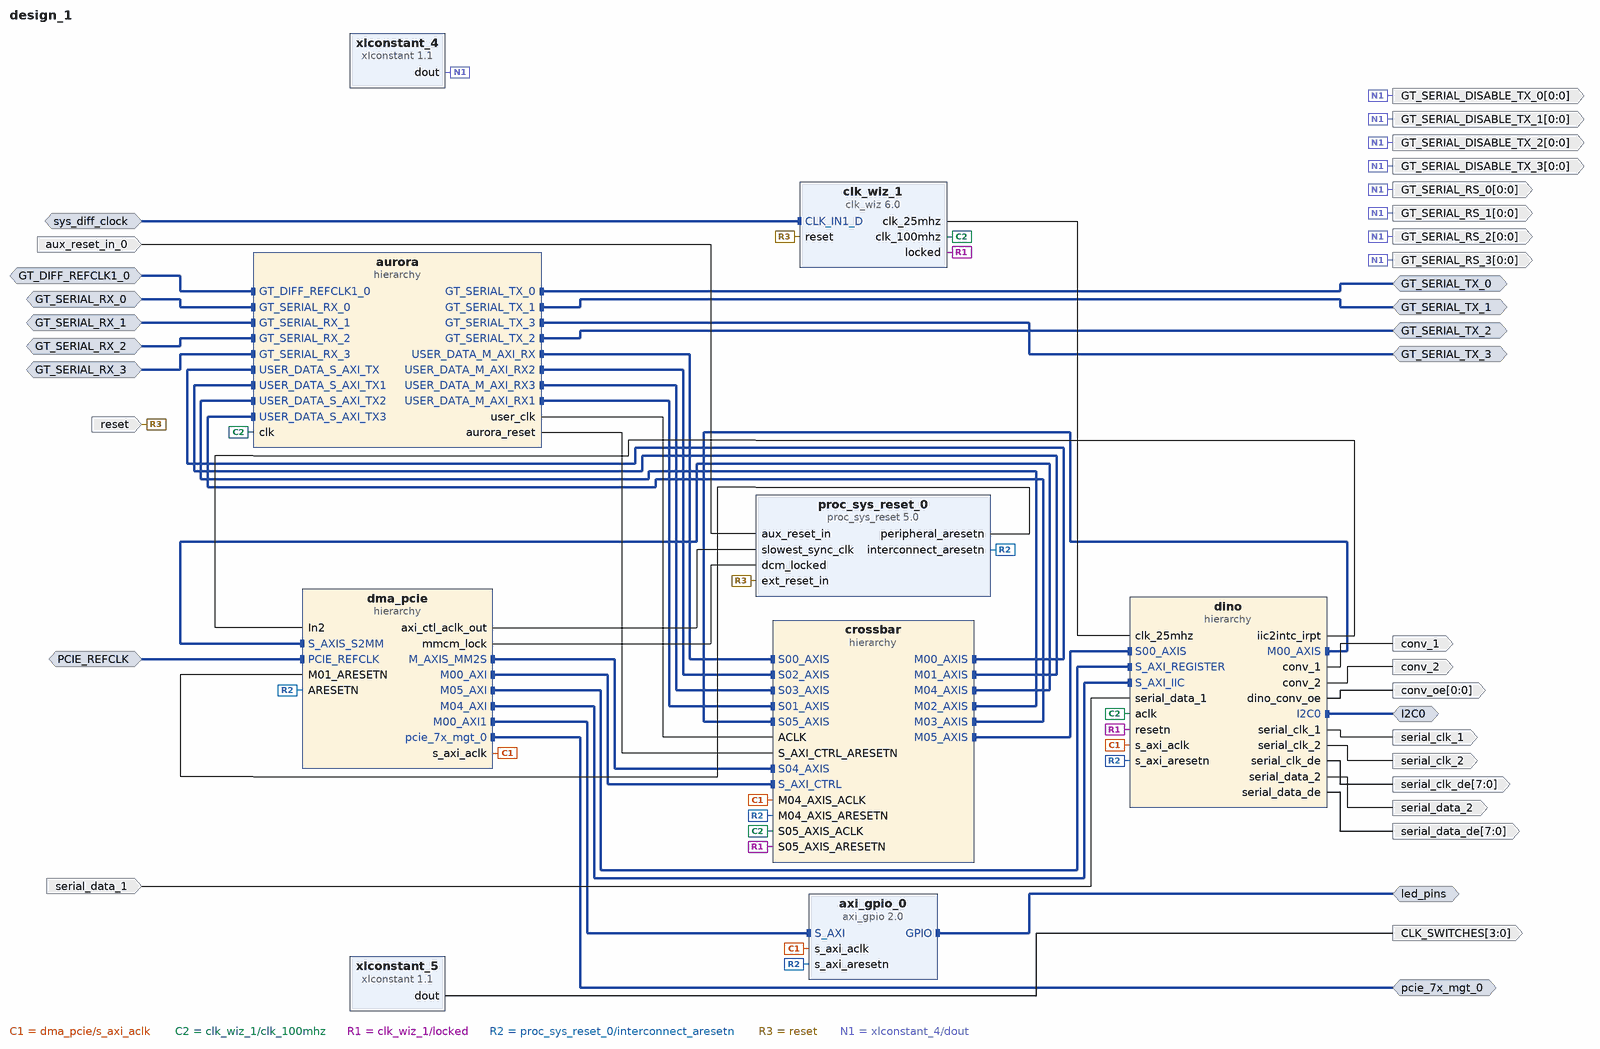
[diagram p0: block diagram of the top level]
# Vivado block design design_1, xc7vx485tffg1761-2, Vivado 2021.1
create_bd_design design_1

create_bd_intf_port -mode Slave -vlnv xilinx.com:display_aurora:GT_Serial_Transceiver_Pins_RX_rtl:1.0 GT_SERIAL_RX_0
create_bd_intf_port -mode Master -vlnv xilinx.com:display_aurora:GT_Serial_Transceiver_Pins_TX_rtl:1.0 GT_SERIAL_TX_0
create_bd_intf_port -mode Slave -vlnv xilinx.com:interface:diff_clock_rtl:1.0 GT_DIFF_REFCLK1_0
set_property -dict {CONFIG.FREQ_HZ 250000000} [get_bd_intf_ports GT_DIFF_REFCLK1_0]
create_bd_intf_port -mode Slave -vlnv xilinx.com:display_aurora:GT_Serial_Transceiver_Pins_RX_rtl:1.0 GT_SERIAL_RX_1
create_bd_intf_port -mode Master -vlnv xilinx.com:display_aurora:GT_Serial_Transceiver_Pins_TX_rtl:1.0 GT_SERIAL_TX_1
create_bd_intf_port -mode Slave -vlnv xilinx.com:interface:diff_clock_rtl:1.0 sys_diff_clock
set_property -dict {CONFIG.FREQ_HZ 200000000} [get_bd_intf_ports sys_diff_clock]
create_bd_intf_port -mode Slave -vlnv xilinx.com:display_aurora:GT_Serial_Transceiver_Pins_RX_rtl:1.0 GT_SERIAL_RX_2
create_bd_intf_port -mode Slave -vlnv xilinx.com:display_aurora:GT_Serial_Transceiver_Pins_RX_rtl:1.0 GT_SERIAL_RX_3
create_bd_intf_port -mode Master -vlnv xilinx.com:display_aurora:GT_Serial_Transceiver_Pins_TX_rtl:1.0 GT_SERIAL_TX_2
create_bd_intf_port -mode Master -vlnv xilinx.com:display_aurora:GT_Serial_Transceiver_Pins_TX_rtl:1.0 GT_SERIAL_TX_3
create_bd_intf_port -mode Slave -vlnv xilinx.com:interface:diff_clock_rtl:1.0 PCIE_REFCLK
create_bd_intf_port -mode Master -vlnv xilinx.com:interface:gpio_rtl:1.0 led_pins
create_bd_intf_port -mode Master -vlnv xilinx.com:interface:pcie_7x_mgt_rtl:1.0 pcie_7x_mgt_0
create_bd_intf_port -mode Master -vlnv xilinx.com:interface:iic_rtl:1.0 I2C0
create_bd_port -dir I -type rst reset
set_property -dict {CONFIG.POLARITY ACTIVE_HIGH} [get_bd_ports reset]
create_bd_port -dir O -from 0 -to 0 GT_SERIAL_DISABLE_TX_1
create_bd_port -dir O -from 0 -to 0 GT_SERIAL_DISABLE_TX_0
create_bd_port -dir O -from 3 -to 0 CLK_SWITCHES
create_bd_port -dir O -from 0 -to 0 GT_SERIAL_DISABLE_TX_2
create_bd_port -dir O -from 0 -to 0 GT_SERIAL_DISABLE_TX_3
create_bd_port -dir O -from 0 -to 0 GT_SERIAL_RS_0
create_bd_port -dir O -from 0 -to 0 GT_SERIAL_RS_1
create_bd_port -dir O -from 0 -to 0 GT_SERIAL_RS_2
create_bd_port -dir O -from 0 -to 0 GT_SERIAL_RS_3
create_bd_port -dir I -type rst aux_reset_in_0
create_bd_port -dir I serial_data_1
create_bd_port -dir O conv_1
create_bd_port -dir O -type clk serial_clk_1
set_property -dict {CONFIG.FREQ_HZ 25000000} [get_bd_ports serial_clk_1]
create_bd_port -dir O serial_data_2
create_bd_port -dir O -type clk serial_clk_2
set_property -dict {CONFIG.FREQ_HZ 25000000} [get_bd_ports serial_clk_2]
create_bd_port -dir O conv_2
create_bd_port -dir O -from 0 -to 0 conv_oe
create_bd_port -dir O -from 7 -to 0 serial_data_de
create_bd_port -dir O -from 7 -to 0 serial_clk_de

create_bd_cell -type ip -vlnv xilinx.com:ip:xlconstant:1.1 xlconstant_4
set_property -dict {CONFIG.CONST_VAL 0} [get_bd_cells xlconstant_4]
create_bd_cell -type ip -vlnv xilinx.com:ip:xlconstant:1.1 xlconstant_5
set_property -dict {CONFIG.CONST_VAL 0b0101 CONFIG.CONST_WIDTH 4} [get_bd_cells xlconstant_5]
create_bd_cell -type ip -vlnv xilinx.com:ip:proc_sys_reset:5.0 proc_sys_reset_0
set_property -dict {CONFIG.RESET_BOARD_INTERFACE reset} [get_bd_cells proc_sys_reset_0]
create_bd_cell -type ip -vlnv xilinx.com:ip:axi_gpio:2.0 axi_gpio_0
set_property -dict {CONFIG.GPIO_BOARD_INTERFACE led_8bits} [get_bd_cells axi_gpio_0]
create_bd_cell -type hier dma_pcie
create_bd_cell -type hier aurora
create_bd_cell -type hier crossbar
create_bd_cell -type ip -vlnv xilinx.com:ip:clk_wiz:6.0 clk_wiz_1
set_property -dict [list \
  CONFIG.CLKIN1_JITTER_PS 50.0 \
  CONFIG.CLKOUT1_DRIVES BUFG \
  CONFIG.CLKOUT1_JITTER 136.686 \
  CONFIG.CLKOUT1_PHASE_ERROR 105.461 \
  CONFIG.CLKOUT2_DRIVES BUFG \
  CONFIG.CLKOUT2_JITTER 180.172 \
  CONFIG.CLKOUT2_PHASE_ERROR 105.461 \
  CONFIG.CLKOUT2_REQUESTED_OUT_FREQ 25.000 \
  CONFIG.CLKOUT2_USED true \
  CONFIG.CLKOUT3_DRIVES BUFG \
  CONFIG.CLKOUT4_DRIVES BUFG \
  CONFIG.CLKOUT5_DRIVES BUFG \
  CONFIG.CLKOUT6_DRIVES BUFG \
  CONFIG.CLKOUT7_DRIVES BUFG \
  CONFIG.CLK_IN1_BOARD_INTERFACE sys_diff_clock \
  CONFIG.CLK_OUT1_PORT clk_100mhz \
  CONFIG.CLK_OUT2_PORT clk_25mhz \
  CONFIG.FEEDBACK_SOURCE FDBK_AUTO \
  CONFIG.MMCM_BANDWIDTH OPTIMIZED \
  CONFIG.MMCM_CLKFBOUT_MULT_F 9 \
  CONFIG.MMCM_CLKIN1_PERIOD 5.000 \
  CONFIG.MMCM_CLKIN2_PERIOD 10.0 \
  CONFIG.MMCM_CLKOUT0_DIVIDE_F 9 \
  CONFIG.MMCM_CLKOUT1_DIVIDE 36 \
  CONFIG.MMCM_COMPENSATION ZHOLD \
  CONFIG.MMCM_DIVCLK_DIVIDE 2 \
  CONFIG.NUM_OUT_CLKS 2 \
  CONFIG.PRIMITIVE PLL \
  CONFIG.PRIM_IN_FREQ 200.000 \
  CONFIG.PRIM_SOURCE Differential_clock_capable_pin \
  CONFIG.RESET_BOARD_INTERFACE reset \
  CONFIG.USE_BOARD_FLOW true \
] [get_bd_cells clk_wiz_1]
create_bd_cell -type hier dino

# ---- hierarchy /dma_pcie ----
current_bd_instance /dma_pcie
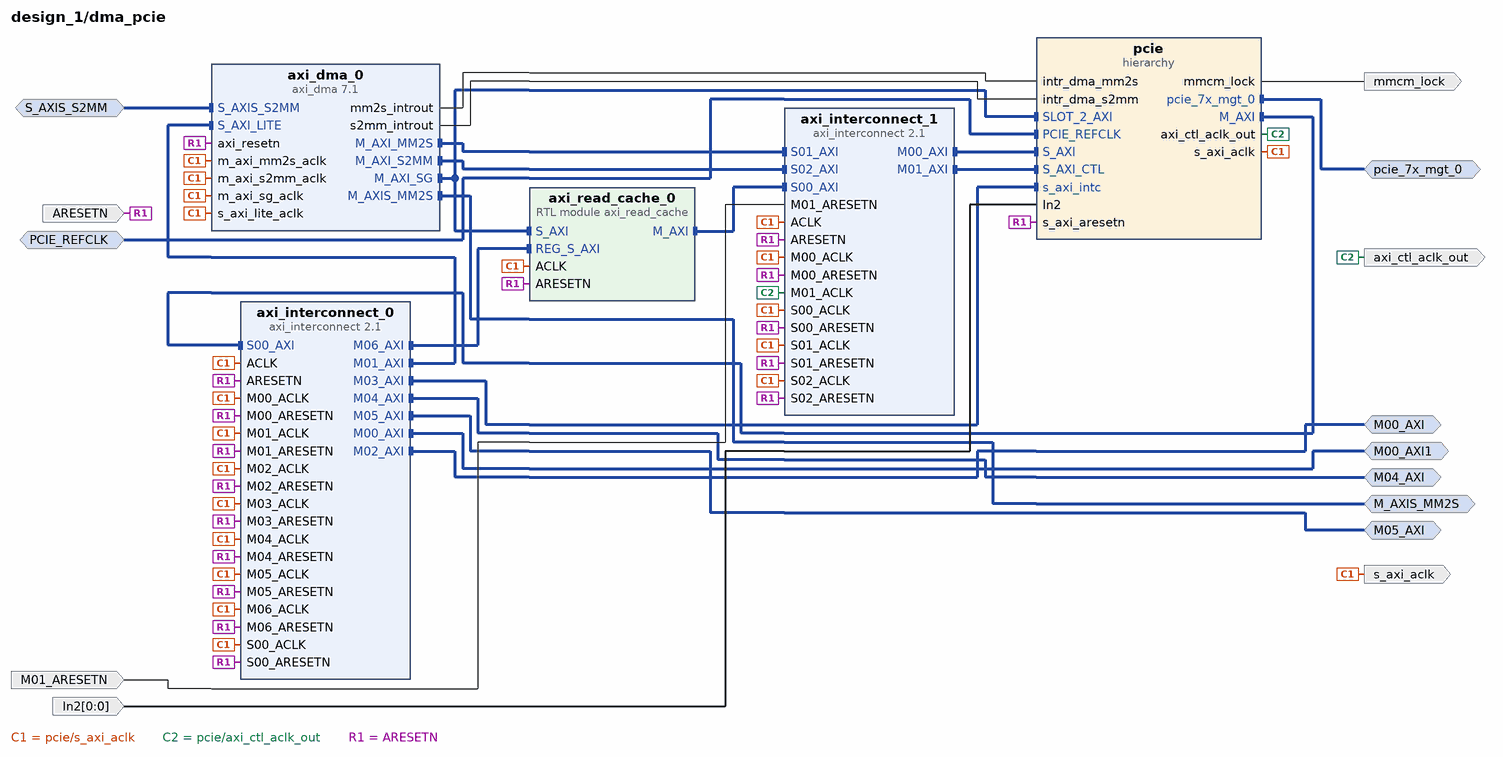
[diagram p1: block diagram inside /dma_pcie]
create_bd_intf_pin -mode Master -vlnv xilinx.com:interface:aximm_rtl:1.0 M00_AXI
create_bd_intf_pin -mode Master -vlnv xilinx.com:interface:axis_rtl:1.0 M_AXIS_MM2S
create_bd_intf_pin -mode Slave -vlnv xilinx.com:interface:axis_rtl:1.0 S_AXIS_S2MM
create_bd_intf_pin -mode Master -vlnv xilinx.com:interface:aximm_rtl:1.0 M00_AXI1
create_bd_intf_pin -mode Slave -vlnv xilinx.com:interface:diff_clock_rtl:1.0 PCIE_REFCLK
create_bd_intf_pin -mode Master -vlnv xilinx.com:interface:pcie_7x_mgt_rtl:1.0 pcie_7x_mgt_0
create_bd_intf_pin -mode Master -vlnv xilinx.com:interface:aximm_rtl:1.0 M04_AXI
create_bd_intf_pin -mode Master -vlnv xilinx.com:interface:aximm_rtl:1.0 M05_AXI
create_bd_pin -dir O -type clk s_axi_aclk
create_bd_pin -dir I -type rst ARESETN
create_bd_pin -dir O -type clk axi_ctl_aclk_out
create_bd_pin -dir I -type rst M01_ARESETN
create_bd_pin -dir O mmcm_lock
create_bd_pin -dir I -from 0 -to 0 In2

create_bd_cell -type ip -vlnv xilinx.com:ip:axi_dma:7.1 axi_dma_0
set_property -dict {CONFIG.c_include_sg 1 CONFIG.c_micro_dma 0 CONFIG.c_sg_include_stscntrl_strm 0} [get_bd_cells axi_dma_0]
create_bd_cell -type ip -vlnv xilinx.com:ip:axi_interconnect:2.1 axi_interconnect_0
set_property -dict {CONFIG.NUM_MI 7} [get_bd_cells axi_interconnect_0]
create_bd_cell -type ip -vlnv xilinx.com:ip:axi_interconnect:2.1 axi_interconnect_1
set_property -dict {CONFIG.NUM_MI 2 CONFIG.NUM_SI 3} [get_bd_cells axi_interconnect_1]
create_bd_cell -type hier pcie
create_bd_cell -type module -reference axi_read_cache axi_read_cache_0

# ---- hierarchy /dma_pcie/pcie ----
current_bd_instance /dma_pcie/pcie
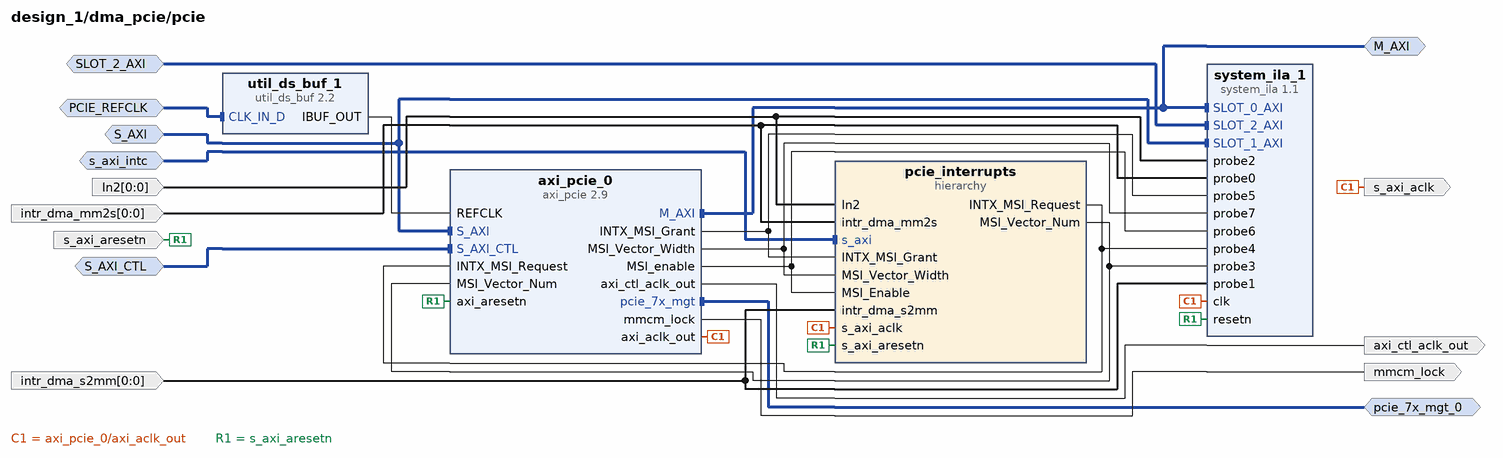
[diagram p2: block diagram inside /dma_pcie/pcie]
create_bd_intf_pin -mode Slave -vlnv xilinx.com:interface:diff_clock_rtl:1.0 PCIE_REFCLK
create_bd_intf_pin -mode Master -vlnv xilinx.com:interface:aximm_rtl:1.0 M_AXI
create_bd_intf_pin -mode Slave -vlnv xilinx.com:interface:aximm_rtl:1.0 S_AXI
create_bd_intf_pin -mode Slave -vlnv xilinx.com:interface:aximm_rtl:1.0 S_AXI_CTL
create_bd_intf_pin -mode Master -vlnv xilinx.com:interface:pcie_7x_mgt_rtl:1.0 pcie_7x_mgt_0
create_bd_intf_pin -mode Slave -vlnv xilinx.com:interface:aximm_rtl:1.0 s_axi_intc
create_bd_intf_pin -mode Monitor -vlnv xilinx.com:interface:aximm_rtl:1.0 SLOT_2_AXI
create_bd_pin -dir I -type rst s_axi_aresetn
create_bd_pin -dir O -type clk s_axi_aclk
create_bd_pin -dir O -type clk axi_ctl_aclk_out
create_bd_pin -dir O mmcm_lock
create_bd_pin -dir I -from 0 -to 0 intr_dma_mm2s
create_bd_pin -dir I -from 0 -to 0 intr_dma_s2mm
create_bd_pin -dir I -from 0 -to 0 In2

create_bd_cell -type ip -vlnv xilinx.com:ip:util_ds_buf:2.2 util_ds_buf_1
set_property -dict {CONFIG.C_BUF_TYPE IBUFDSGTE} [get_bd_cells util_ds_buf_1]
create_bd_cell -type ip -vlnv xilinx.com:ip:axi_pcie:2.9 axi_pcie_0
set_property -dict [list \
  CONFIG.AXIBAR2PCIEBAR_0 0x00000000 \
  CONFIG.BAR0_SCALE Megabytes \
  CONFIG.BAR0_SIZE 1 \
  CONFIG.DEVICE_ID 0x7021 \
  CONFIG.MAX_LINK_SPEED 5.0_GT/s \
  CONFIG.M_AXI_DATA_WIDTH 64 \
  CONFIG.NUM_MSI_REQ 4 \
  CONFIG.S_AXI_DATA_WIDTH 64 \
  CONFIG.XLNX_REF_BOARD VC707 \
] [get_bd_cells axi_pcie_0]
create_bd_cell -type hier pcie_interrupts
create_bd_cell -type ip -vlnv xilinx.com:ip:system_ila:1.1 system_ila_1
set_property -dict [list \
  CONFIG.C_DATA_DEPTH 16384 \
  CONFIG.C_MON_TYPE MIX \
  CONFIG.C_NUM_MONITOR_SLOTS 3 \
  CONFIG.C_NUM_OF_PROBES 8 \
  CONFIG.C_SLOT 2 \
  CONFIG.C_SLOT_2_INTF_TYPE xilinx.com:interface:aximm_rtl:1.0 \
  CONFIG.C_SLOT_3_INTF_TYPE xilinx.com:interface:axis_rtl:1.0 \
] [get_bd_cells system_ila_1]

# ---- hierarchy /dma_pcie/pcie/pcie_interrupts ----
current_bd_instance /dma_pcie/pcie/pcie_interrupts
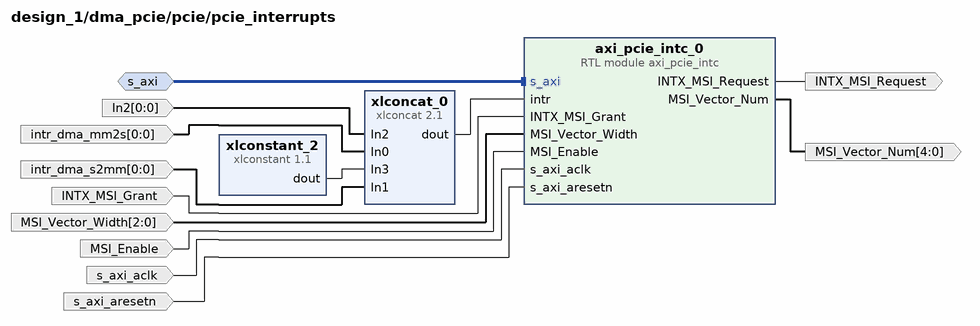
[diagram p3: block diagram inside /dma_pcie/pcie/pcie_interrupts]
create_bd_intf_pin -mode Slave -vlnv xilinx.com:interface:aximm_rtl:1.0 s_axi
create_bd_pin -dir I -from 0 -to 0 intr_dma_mm2s
create_bd_pin -dir I -from 0 -to 0 intr_dma_s2mm
create_bd_pin -dir I -type clk s_axi_aclk
create_bd_pin -dir I -type rst s_axi_aresetn
create_bd_pin -dir O INTX_MSI_Request
create_bd_pin -dir I INTX_MSI_Grant
create_bd_pin -dir O -from 4 -to 0 MSI_Vector_Num
create_bd_pin -dir I MSI_Enable
create_bd_pin -dir I -from 2 -to 0 MSI_Vector_Width
create_bd_pin -dir I -from 0 -to 0 In2

create_bd_cell -type ip -vlnv xilinx.com:ip:xlconcat:2.1 xlconcat_0
set_property -dict {CONFIG.NUM_PORTS 4} [get_bd_cells xlconcat_0]
create_bd_cell -type ip -vlnv xilinx.com:ip:xlconstant:1.1 xlconstant_2
set_property -dict {CONFIG.CONST_VAL 0 CONFIG.CONST_WIDTH 1} [get_bd_cells xlconstant_2]
create_bd_cell -type module -reference axi_pcie_intc axi_pcie_intc_0

# ---- hierarchy /aurora ----
current_bd_instance /aurora
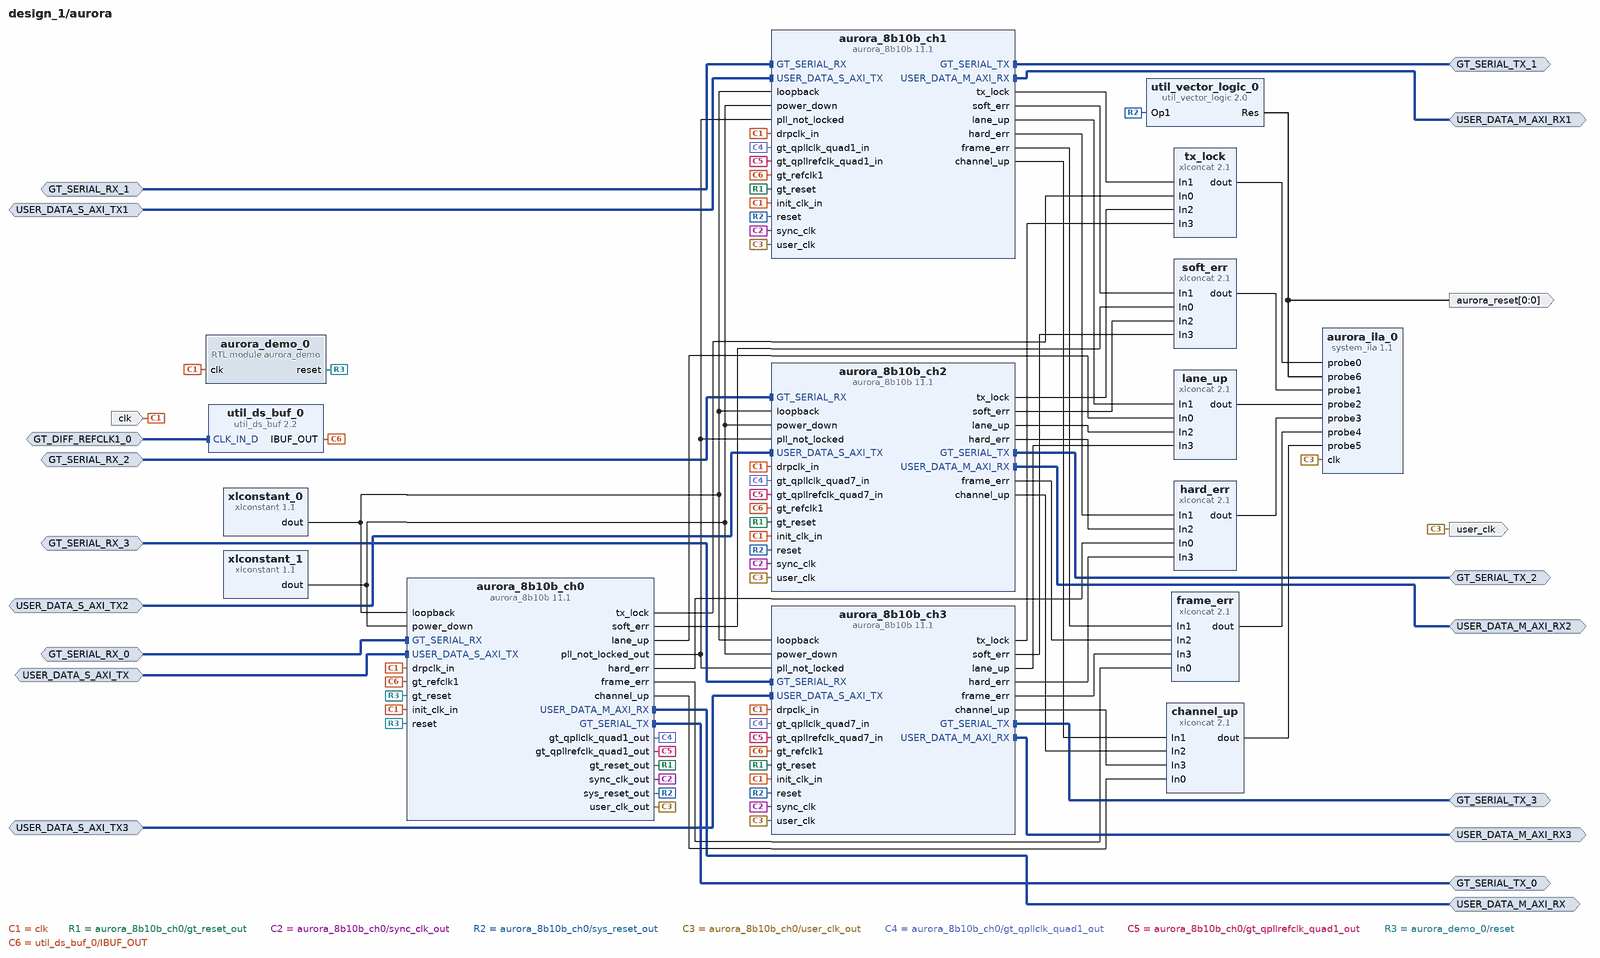
[diagram p4: block diagram inside /aurora]
create_bd_intf_pin -mode Slave -vlnv xilinx.com:interface:diff_clock_rtl:1.0 GT_DIFF_REFCLK1_0
create_bd_intf_pin -mode Slave -vlnv xilinx.com:interface:axis_rtl:1.0 USER_DATA_S_AXI_TX
create_bd_intf_pin -mode Master -vlnv xilinx.com:interface:axis_rtl:1.0 USER_DATA_M_AXI_RX
create_bd_intf_pin -mode Master -vlnv xilinx.com:display_aurora:GT_Serial_Transceiver_Pins_TX_rtl:1.0 GT_SERIAL_TX_0
create_bd_intf_pin -mode Slave -vlnv xilinx.com:display_aurora:GT_Serial_Transceiver_Pins_RX_rtl:1.0 GT_SERIAL_RX_0
create_bd_intf_pin -mode Slave -vlnv xilinx.com:interface:axis_rtl:1.0 USER_DATA_S_AXI_TX1
create_bd_intf_pin -mode Master -vlnv xilinx.com:interface:axis_rtl:1.0 USER_DATA_M_AXI_RX1
create_bd_intf_pin -mode Master -vlnv xilinx.com:display_aurora:GT_Serial_Transceiver_Pins_TX_rtl:1.0 GT_SERIAL_TX_1
create_bd_intf_pin -mode Slave -vlnv xilinx.com:display_aurora:GT_Serial_Transceiver_Pins_RX_rtl:1.0 GT_SERIAL_RX_1
create_bd_intf_pin -mode Slave -vlnv xilinx.com:interface:axis_rtl:1.0 USER_DATA_S_AXI_TX2
create_bd_intf_pin -mode Master -vlnv xilinx.com:interface:axis_rtl:1.0 USER_DATA_M_AXI_RX2
create_bd_intf_pin -mode Master -vlnv xilinx.com:display_aurora:GT_Serial_Transceiver_Pins_TX_rtl:1.0 GT_SERIAL_TX_2
create_bd_intf_pin -mode Slave -vlnv xilinx.com:display_aurora:GT_Serial_Transceiver_Pins_RX_rtl:1.0 GT_SERIAL_RX_2
create_bd_intf_pin -mode Slave -vlnv xilinx.com:interface:axis_rtl:1.0 USER_DATA_S_AXI_TX3
create_bd_intf_pin -mode Master -vlnv xilinx.com:interface:axis_rtl:1.0 USER_DATA_M_AXI_RX3
create_bd_intf_pin -mode Master -vlnv xilinx.com:display_aurora:GT_Serial_Transceiver_Pins_TX_rtl:1.0 GT_SERIAL_TX_3
create_bd_intf_pin -mode Slave -vlnv xilinx.com:display_aurora:GT_Serial_Transceiver_Pins_RX_rtl:1.0 GT_SERIAL_RX_3
create_bd_pin -dir O -type clk user_clk
create_bd_pin -dir O -from 0 -to 0 aurora_reset
create_bd_pin -dir I -type clk clk

create_bd_cell -type ip -vlnv xilinx.com:ip:xlconcat:2.1 lane_up
set_property -dict {CONFIG.NUM_PORTS 4} [get_bd_cells lane_up]
create_bd_cell -type ip -vlnv xilinx.com:ip:util_ds_buf:2.2 util_ds_buf_0
set_property -dict {CONFIG.C_BUF_TYPE IBUFDSGTE} [get_bd_cells util_ds_buf_0]
create_bd_cell -type module -reference aurora_demo aurora_demo_0
create_bd_cell -type ip -vlnv xilinx.com:ip:aurora_8b10b:11.1 aurora_8b10b_ch0
set_property -dict [list \
  CONFIG.C_DRP_IF false \
  CONFIG.C_GT_CLOCK_1 GTXQ0 \
  CONFIG.C_GT_LOC_1 1 \
  CONFIG.C_GT_LOC_15 X \
  CONFIG.C_GT_LOC_28 X \
  CONFIG.C_LANE_WIDTH 4 \
  CONFIG.C_LINE_RATE 2 \
  CONFIG.C_REFCLK_FREQUENCY 250.000 \
  CONFIG.C_REFCLK_SOURCE none \
  CONFIG.C_START_LANE X0Y0 \
  CONFIG.C_START_QUAD X0Y0 \
  CONFIG.C_USE_CRC true \
  CONFIG.SINGLEEND_GTREFCLK true \
  CONFIG.SINGLEEND_INITCLK true \
  CONFIG.SupportLevel 1 \
] [get_bd_cells aurora_8b10b_ch0]
create_bd_cell -type ip -vlnv xilinx.com:ip:util_vector_logic:2.0 util_vector_logic_0
set_property -dict {CONFIG.C_OPERATION not CONFIG.C_SIZE 1} [get_bd_cells util_vector_logic_0]
create_bd_cell -type ip -vlnv xilinx.com:ip:xlconcat:2.1 hard_err
set_property -dict {CONFIG.NUM_PORTS 4} [get_bd_cells hard_err]
create_bd_cell -type ip -vlnv xilinx.com:ip:xlconcat:2.1 frame_err
set_property -dict {CONFIG.NUM_PORTS 4} [get_bd_cells frame_err]
create_bd_cell -type ip -vlnv xilinx.com:ip:xlconstant:1.1 xlconstant_0
set_property -dict {CONFIG.CONST_VAL 0 CONFIG.CONST_WIDTH 3} [get_bd_cells xlconstant_0]
create_bd_cell -type ip -vlnv xilinx.com:ip:aurora_8b10b:11.1 aurora_8b10b_ch1
set_property -dict [list \
  CONFIG.C_DRP_IF false \
  CONFIG.C_GT_CLOCK_1 GTXQ0 \
  CONFIG.C_GT_LOC_1 1 \
  CONFIG.C_GT_LOC_11 X \
  CONFIG.C_GT_LOC_27 X \
  CONFIG.C_LANE_WIDTH 4 \
  CONFIG.C_LINE_RATE 2 \
  CONFIG.C_REFCLK_FREQUENCY 250.000 \
  CONFIG.C_REFCLK_SOURCE none \
  CONFIG.C_START_LANE X0Y0 \
  CONFIG.C_START_QUAD X0Y0 \
  CONFIG.C_USE_CRC true \
  CONFIG.SupportLevel 0 \
] [get_bd_cells aurora_8b10b_ch1]
create_bd_cell -type ip -vlnv xilinx.com:ip:xlconcat:2.1 tx_lock
set_property -dict {CONFIG.NUM_PORTS 4} [get_bd_cells tx_lock]
create_bd_cell -type ip -vlnv xilinx.com:ip:aurora_8b10b:11.1 aurora_8b10b_ch2
set_property -dict [list \
  CONFIG.C_DRP_IF false \
  CONFIG.C_GT_CLOCK_1 GTXQ6 \
  CONFIG.C_GT_LOC_1 X \
  CONFIG.C_GT_LOC_26 1 \
  CONFIG.C_LANE_WIDTH 4 \
  CONFIG.C_LINE_RATE 2 \
  CONFIG.C_REFCLK_FREQUENCY 250.000 \
  CONFIG.C_USE_CRC true \
] [get_bd_cells aurora_8b10b_ch2]
create_bd_cell -type ip -vlnv xilinx.com:ip:xlconstant:1.1 xlconstant_1
set_property -dict {CONFIG.CONST_VAL 0} [get_bd_cells xlconstant_1]
create_bd_cell -type ip -vlnv xilinx.com:ip:aurora_8b10b:11.1 aurora_8b10b_ch3
set_property -dict [list \
  CONFIG.C_DRP_IF false \
  CONFIG.C_GT_CLOCK_1 GTXQ6 \
  CONFIG.C_GT_LOC_1 X \
  CONFIG.C_GT_LOC_25 1 \
  CONFIG.C_LANE_WIDTH 4 \
  CONFIG.C_LINE_RATE 2 \
  CONFIG.C_REFCLK_FREQUENCY 250.000 \
  CONFIG.C_USE_CRC true \
] [get_bd_cells aurora_8b10b_ch3]
create_bd_cell -type ip -vlnv xilinx.com:ip:xlconcat:2.1 channel_up
set_property -dict {CONFIG.NUM_PORTS 4} [get_bd_cells channel_up]
create_bd_cell -type ip -vlnv xilinx.com:ip:xlconcat:2.1 soft_err
set_property -dict {CONFIG.NUM_PORTS 4} [get_bd_cells soft_err]
create_bd_cell -type ip -vlnv xilinx.com:ip:system_ila:1.1 aurora_ila_0
set_property -dict {CONFIG.C_DATA_DEPTH 4096 CONFIG.C_MON_TYPE NATIVE CONFIG.C_NUM_OF_PROBES 7} [get_bd_cells aurora_ila_0]

# ---- hierarchy /crossbar ----
current_bd_instance /crossbar
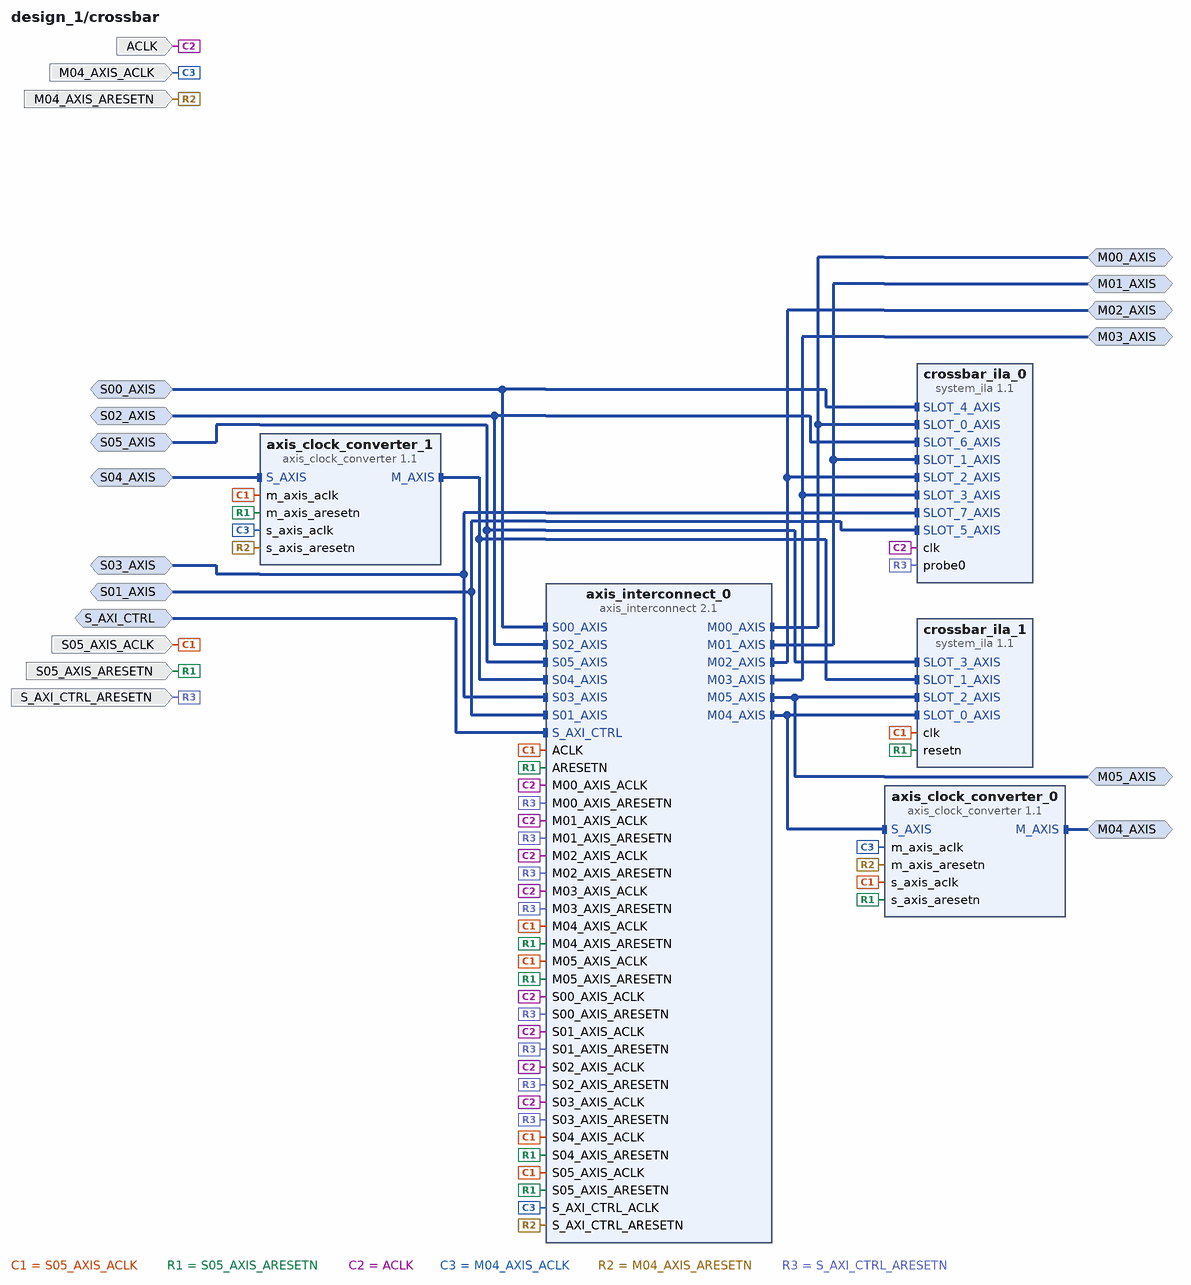
[diagram p5: block diagram inside /crossbar]
create_bd_intf_pin -mode Master -vlnv xilinx.com:interface:axis_rtl:1.0 M00_AXIS
create_bd_intf_pin -mode Master -vlnv xilinx.com:interface:axis_rtl:1.0 M01_AXIS
create_bd_intf_pin -mode Master -vlnv xilinx.com:interface:axis_rtl:1.0 M02_AXIS
create_bd_intf_pin -mode Master -vlnv xilinx.com:interface:axis_rtl:1.0 M03_AXIS
create_bd_intf_pin -mode Slave -vlnv xilinx.com:interface:axis_rtl:1.0 S00_AXIS
create_bd_intf_pin -mode Slave -vlnv xilinx.com:interface:axis_rtl:1.0 S01_AXIS
create_bd_intf_pin -mode Slave -vlnv xilinx.com:interface:axis_rtl:1.0 S02_AXIS
create_bd_intf_pin -mode Slave -vlnv xilinx.com:interface:axis_rtl:1.0 S03_AXIS
create_bd_intf_pin -mode Slave -vlnv xilinx.com:interface:aximm_rtl:1.0 S_AXI_CTRL
create_bd_intf_pin -mode Slave -vlnv xilinx.com:interface:axis_rtl:1.0 S04_AXIS
create_bd_intf_pin -mode Master -vlnv xilinx.com:interface:axis_rtl:1.0 M04_AXIS
create_bd_intf_pin -mode Master -vlnv xilinx.com:interface:axis_rtl:1.0 M05_AXIS
create_bd_intf_pin -mode Slave -vlnv xilinx.com:interface:axis_rtl:1.0 S05_AXIS
create_bd_pin -dir I -type clk ACLK
create_bd_pin -dir I -type rst S_AXI_CTRL_ARESETN
create_bd_pin -dir I -type clk M04_AXIS_ACLK
create_bd_pin -dir I -type rst M04_AXIS_ARESETN
create_bd_pin -dir I -type rst S05_AXIS_ARESETN
create_bd_pin -dir I -type clk S05_AXIS_ACLK

create_bd_cell -type ip -vlnv xilinx.com:ip:system_ila:1.1 crossbar_ila_0
set_property -dict [list \
  CONFIG.C_DATA_DEPTH 4096 \
  CONFIG.C_MON_TYPE MIX \
  CONFIG.C_NUM_MONITOR_SLOTS 8 \
  CONFIG.C_NUM_OF_PROBES 1 \
  CONFIG.C_SLOT 0 \
  CONFIG.C_SLOT_0_INTF_TYPE xilinx.com:interface:axis_rtl:1.0 \
  CONFIG.C_SLOT_10_INTF_TYPE xilinx.com:interface:axis_rtl:1.0 \
  CONFIG.C_SLOT_11_INTF_TYPE xilinx.com:interface:axis_rtl:1.0 \
  CONFIG.C_SLOT_12_INTF_TYPE xilinx.com:interface:axis_rtl:1.0 \
  CONFIG.C_SLOT_1_INTF_TYPE xilinx.com:interface:axis_rtl:1.0 \
  CONFIG.C_SLOT_2_INTF_TYPE xilinx.com:interface:axis_rtl:1.0 \
  CONFIG.C_SLOT_3_INTF_TYPE xilinx.com:interface:axis_rtl:1.0 \
  CONFIG.C_SLOT_4_INTF_TYPE xilinx.com:interface:axis_rtl:1.0 \
  CONFIG.C_SLOT_5_INTF_TYPE xilinx.com:interface:axis_rtl:1.0 \
  CONFIG.C_SLOT_6_INTF_TYPE xilinx.com:interface:axis_rtl:1.0 \
  CONFIG.C_SLOT_7_INTF_TYPE xilinx.com:interface:axis_rtl:1.0 \
  CONFIG.C_SLOT_8_INTF_TYPE xilinx.com:interface:aximm_rtl:1.0 \
  CONFIG.C_SLOT_9_INTF_TYPE xilinx.com:interface:axis_rtl:1.0 \
] [get_bd_cells crossbar_ila_0]
create_bd_cell -type ip -vlnv xilinx.com:ip:axis_interconnect:2.1 axis_interconnect_0
set_property -dict [list \
  CONFIG.ENABLE_ADVANCED_OPTIONS 1 \
  CONFIG.M00_FIFO_DEPTH 32 \
  CONFIG.M00_FIFO_MODE 0 \
  CONFIG.M01_FIFO_DEPTH 32 \
  CONFIG.M01_FIFO_MODE 0 \
  CONFIG.M02_FIFO_DEPTH 32 \
  CONFIG.M02_FIFO_MODE 0 \
  CONFIG.M03_FIFO_DEPTH 32 \
  CONFIG.M03_FIFO_MODE 0 \
  CONFIG.M04_FIFO_DEPTH 32 \
  CONFIG.M04_FIFO_MODE 0 \
  CONFIG.M05_FIFO_DEPTH 0 \
  CONFIG.M06_FIFO_DEPTH 4096 \
  CONFIG.M06_FIFO_MODE 1 \
  CONFIG.NUM_MI 6 \
  CONFIG.NUM_SI 6 \
  CONFIG.ROUTING_MODE 1 \
  CONFIG.S00_FIFO_DEPTH 32 \
  CONFIG.S00_FIFO_MODE 0 \
  CONFIG.S00_HAS_REGSLICE 0 \
  CONFIG.S01_FIFO_DEPTH 32 \
  CONFIG.S01_FIFO_MODE 0 \
  CONFIG.S02_FIFO_DEPTH 32 \
  CONFIG.S02_FIFO_MODE 0 \
  CONFIG.S03_FIFO_DEPTH 32 \
  CONFIG.S03_FIFO_MODE 0 \
  CONFIG.S04_FIFO_DEPTH 32 \
  CONFIG.S04_FIFO_MODE 0 \
  CONFIG.S05_FIFO_DEPTH 0 \
  CONFIG.S06_FIFO_DEPTH 4096 \
  CONFIG.S06_FIFO_MODE 1 \
] [get_bd_cells axis_interconnect_0]
create_bd_cell -type ip -vlnv xilinx.com:ip:system_ila:1.1 crossbar_ila_1
set_property -dict [list \
  CONFIG.C_DATA_DEPTH 4096 \
  CONFIG.C_MON_TYPE INTERFACE \
  CONFIG.C_NUM_MONITOR_SLOTS 4 \
  CONFIG.C_NUM_OF_PROBES 0 \
  CONFIG.C_SLOT 3 \
  CONFIG.C_SLOT_0_INTF_TYPE xilinx.com:interface:axis_rtl:1.0 \
  CONFIG.C_SLOT_1_INTF_TYPE xilinx.com:interface:axis_rtl:1.0 \
  CONFIG.C_SLOT_2_INTF_TYPE xilinx.com:interface:axis_rtl:1.0 \
  CONFIG.C_SLOT_3_INTF_TYPE xilinx.com:interface:axis_rtl:1.0 \
] [get_bd_cells crossbar_ila_1]
create_bd_cell -type ip -vlnv xilinx.com:ip:axis_clock_converter:1.1 axis_clock_converter_0
create_bd_cell -type ip -vlnv xilinx.com:ip:axis_clock_converter:1.1 axis_clock_converter_1

# ---- hierarchy /dino ----
current_bd_instance /dino
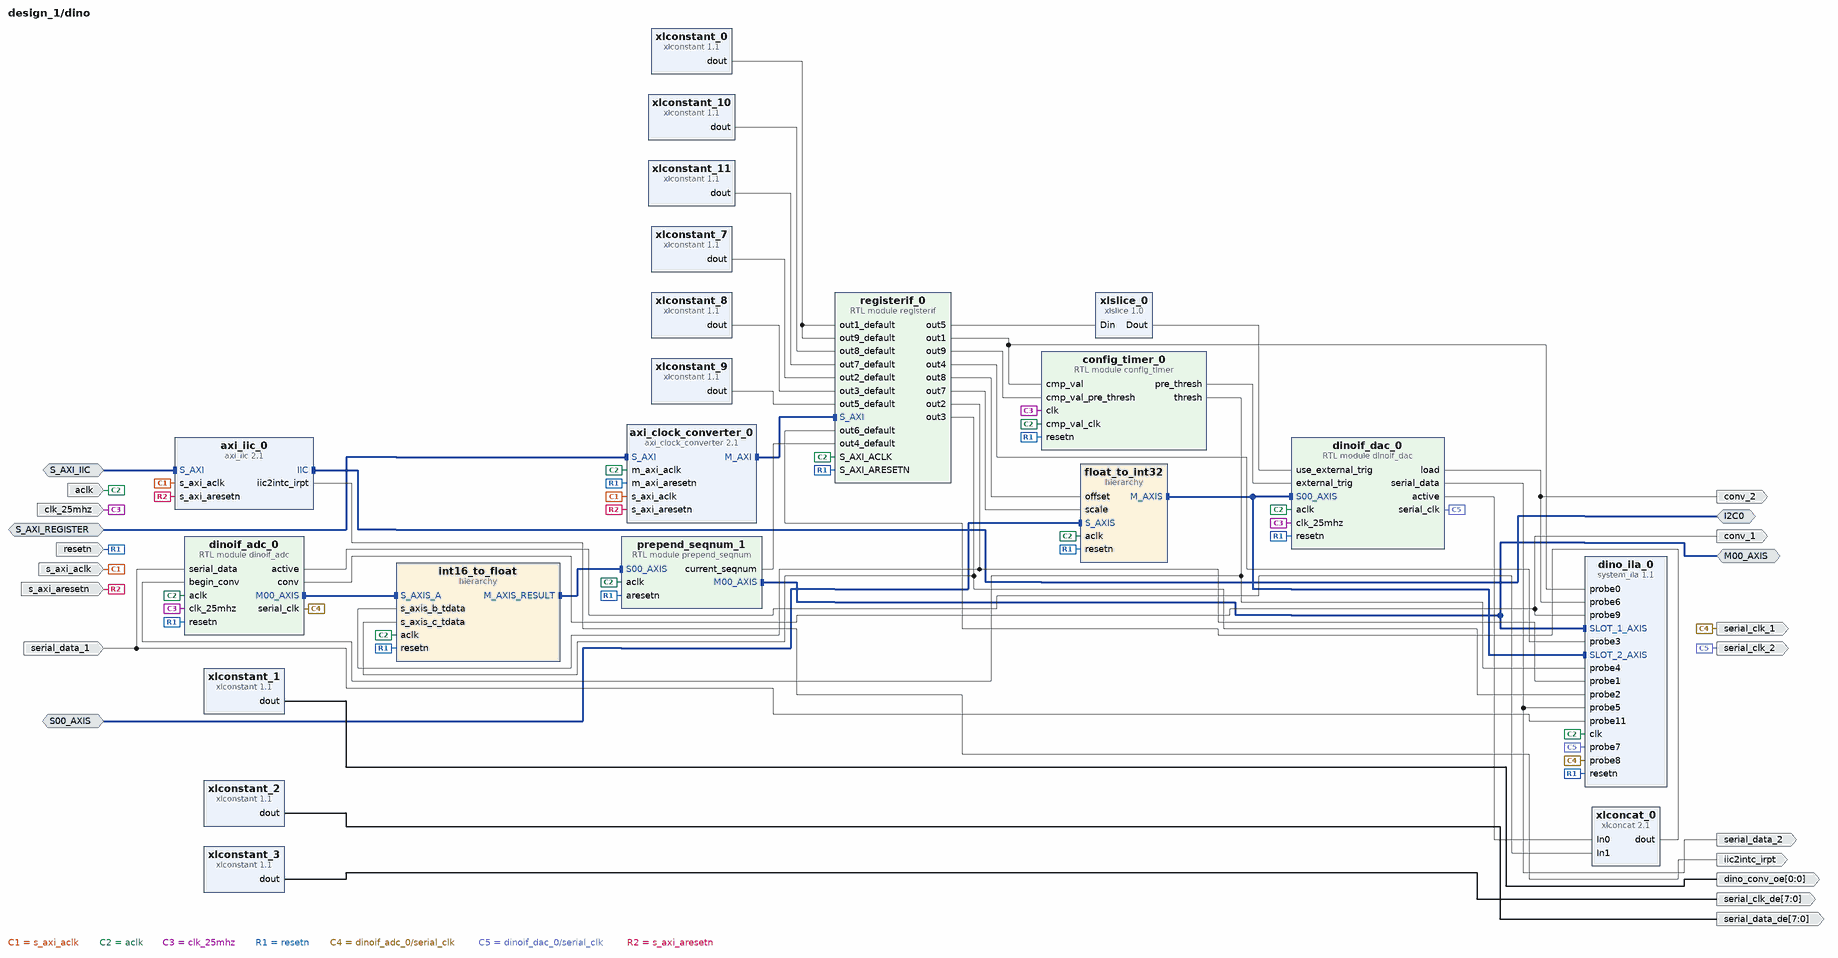
[diagram p6: block diagram inside /dino]
create_bd_intf_pin -mode Slave -vlnv xilinx.com:interface:axis_rtl:1.0 S00_AXIS
create_bd_intf_pin -mode Master -vlnv xilinx.com:interface:axis_rtl:1.0 M00_AXIS
create_bd_intf_pin -mode Slave -vlnv xilinx.com:interface:aximm_rtl:1.0 S_AXI_IIC
create_bd_intf_pin -mode Master -vlnv xilinx.com:interface:iic_rtl:1.0 I2C0
create_bd_intf_pin -mode Slave -vlnv xilinx.com:interface:aximm_rtl:1.0 S_AXI_REGISTER
create_bd_pin -dir I -type clk aclk
create_bd_pin -dir I -type rst resetn
create_bd_pin -dir I -type clk clk_25mhz
create_bd_pin -dir O serial_data_2
create_bd_pin -dir O conv_2
create_bd_pin -dir O -type clk serial_clk_2
create_bd_pin -dir I serial_data_1
create_bd_pin -dir O conv_1
create_bd_pin -dir O -type clk serial_clk_1
create_bd_pin -dir I -type clk s_axi_aclk
create_bd_pin -dir I -type rst s_axi_aresetn
create_bd_pin -dir O -type intr iic2intc_irpt
create_bd_pin -dir O -from 0 -to 0 dino_conv_oe
create_bd_pin -dir O -from 7 -to 0 serial_data_de
create_bd_pin -dir O -from 7 -to 0 serial_clk_de

create_bd_cell -type ip -vlnv xilinx.com:ip:axi_iic:2.1 axi_iic_0
create_bd_cell -type ip -vlnv xilinx.com:ip:xlconstant:1.1 xlconstant_1
set_property -dict {CONFIG.CONST_WIDTH 1} [get_bd_cells xlconstant_1]
create_bd_cell -type ip -vlnv xilinx.com:ip:xlconstant:1.1 xlconstant_2
set_property -dict {CONFIG.CONST_VAL 0b00000010 CONFIG.CONST_WIDTH 8} [get_bd_cells xlconstant_2]
create_bd_cell -type ip -vlnv xilinx.com:ip:xlconstant:1.1 xlconstant_3
set_property -dict {CONFIG.CONST_VAL 0xFF CONFIG.CONST_WIDTH 8} [get_bd_cells xlconstant_3]
create_bd_cell -type hier int16_to_float
create_bd_cell -type ip -vlnv xilinx.com:ip:xlconstant:1.1 xlconstant_0
set_property -dict {CONFIG.CONST_VAL 1000 CONFIG.CONST_WIDTH 32} [get_bd_cells xlconstant_0]
create_bd_cell -type ip -vlnv xilinx.com:ip:xlconstant:1.1 xlconstant_7
set_property -dict {CONFIG.CONST_VAL 0xbad3b6ee CONFIG.CONST_WIDTH 32} [get_bd_cells xlconstant_7]
create_bd_cell -type ip -vlnv xilinx.com:ip:xlconstant:1.1 xlconstant_8
set_property -dict {CONFIG.CONST_VAL 0x412ce5c9 CONFIG.CONST_WIDTH 32} [get_bd_cells xlconstant_8]
create_bd_cell -type ip -vlnv xilinx.com:ip:xlconstant:1.1 xlconstant_9
set_property -dict {CONFIG.CONST_VAL 0 CONFIG.CONST_WIDTH 32} [get_bd_cells xlconstant_9]
create_bd_cell -type ip -vlnv xilinx.com:ip:axi_clock_converter:2.1 axi_clock_converter_0
create_bd_cell -type ip -vlnv xilinx.com:ip:system_ila:1.1 dino_ila_0
set_property -dict [list \
  CONFIG.C_DATA_DEPTH 65536 \
  CONFIG.C_MON_TYPE MIX \
  CONFIG.C_NUM_MONITOR_SLOTS 3 \
  CONFIG.C_NUM_OF_PROBES 12 \
  CONFIG.C_SLOT 0 \
  CONFIG.C_SLOT_0_INTF_TYPE xilinx.com:interface:axis_rtl:1.0 \
  CONFIG.C_SLOT_1_INTF_TYPE xilinx.com:interface:axis_rtl:1.0 \
  CONFIG.C_SLOT_2_INTF_TYPE xilinx.com:interface:axis_rtl:1.0 \
  CONFIG.C_SLOT_3_INTF_TYPE xilinx.com:interface:axis_rtl:1.0 \
] [get_bd_cells dino_ila_0]
create_bd_cell -type ip -vlnv xilinx.com:ip:xlslice:1.0 xlslice_0
create_bd_cell -type module -reference dinoif_dac dinoif_dac_0
create_bd_cell -type hier float_to_int32
create_bd_cell -type ip -vlnv xilinx.com:ip:xlconcat:2.1 xlconcat_0
set_property -dict {CONFIG.NUM_PORTS 2} [get_bd_cells xlconcat_0]
create_bd_cell -type ip -vlnv xilinx.com:ip:xlconstant:1.1 xlconstant_11
set_property -dict {CONFIG.CONST_VAL 0x454ccc00 CONFIG.CONST_WIDTH 32} [get_bd_cells xlconstant_11]
create_bd_cell -type ip -vlnv xilinx.com:ip:xlconstant:1.1 xlconstant_10
set_property -dict {CONFIG.CONST_VAL 0x41200000 CONFIG.CONST_WIDTH 32} [get_bd_cells xlconstant_10]
create_bd_cell -type module -reference config_timer config_timer_0
create_bd_cell -type module -reference registerif registerif_0
create_bd_cell -type module -reference dinoif_adc dinoif_adc_0
create_bd_cell -type module -reference prepend_seqnum prepend_seqnum_1

# ---- hierarchy /dino/int16_to_float ----
current_bd_instance /dino/int16_to_float
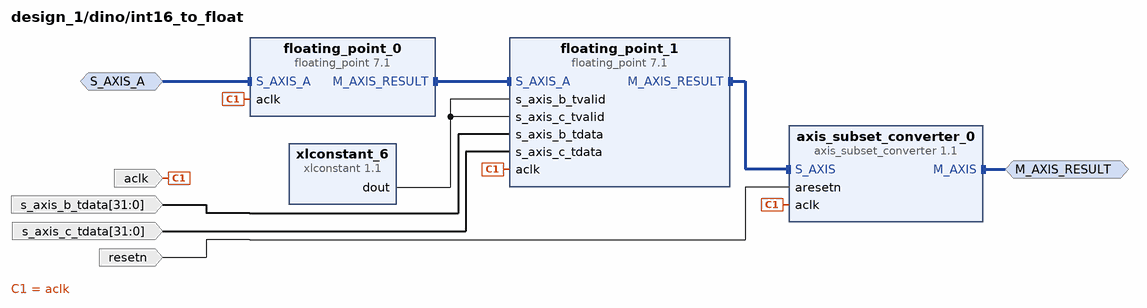
[diagram p7: block diagram inside /dino/int16_to_float]
create_bd_intf_pin -mode Master -vlnv xilinx.com:interface:axis_rtl:1.0 M_AXIS_RESULT
create_bd_intf_pin -mode Slave -vlnv xilinx.com:interface:axis_rtl:1.0 S_AXIS_A
create_bd_pin -dir I -type clk aclk
create_bd_pin -dir I -from 31 -to 0 s_axis_b_tdata
create_bd_pin -dir I -from 31 -to 0 s_axis_c_tdata
create_bd_pin -dir I -type rst resetn

create_bd_cell -type ip -vlnv xilinx.com:ip:floating_point:7.1 floating_point_1
set_property -dict [list \
  CONFIG.Add_Sub_Value Add \
  CONFIG.C_Latency 4 \
  CONFIG.C_Mult_Usage Medium_Usage \
  CONFIG.C_Rate 1 \
  CONFIG.C_Result_Exponent_Width 8 \
  CONFIG.C_Result_Fraction_Width 24 \
  CONFIG.Flow_Control NonBlocking \
  CONFIG.Has_RESULT_TREADY false \
  CONFIG.Maximum_Latency false \
  CONFIG.Operation_Type FMA \
  CONFIG.Result_Precision_Type Single \
] [get_bd_cells floating_point_1]
create_bd_cell -type ip -vlnv xilinx.com:ip:xlconstant:1.1 xlconstant_6
create_bd_cell -type ip -vlnv xilinx.com:ip:floating_point:7.1 floating_point_0
set_property -dict [list \
  CONFIG.A_Precision_Type Custom \
  CONFIG.C_A_Exponent_Width 16 \
  CONFIG.C_A_Fraction_Width 0 \
  CONFIG.C_Accum_Input_Msb 32 \
  CONFIG.C_Accum_Lsb -31 \
  CONFIG.C_Accum_Msb 32 \
  CONFIG.C_Latency 4 \
  CONFIG.C_Mult_Usage No_Usage \
  CONFIG.C_Rate 1 \
  CONFIG.C_Result_Exponent_Width 8 \
  CONFIG.C_Result_Fraction_Width 24 \
  CONFIG.Flow_Control NonBlocking \
  CONFIG.Has_RESULT_TREADY false \
  CONFIG.Maximum_Latency false \
  CONFIG.Operation_Type Fixed_to_float \
  CONFIG.Result_Precision_Type Single \
] [get_bd_cells floating_point_0]
create_bd_cell -type ip -vlnv xilinx.com:ip:axis_subset_converter:1.1 axis_subset_converter_0
set_property -dict [list \
  CONFIG.DEFAULT_TLAST 1 \
  CONFIG.M_HAS_TKEEP 0 \
  CONFIG.M_HAS_TLAST 1 \
  CONFIG.M_HAS_TREADY 0 \
  CONFIG.M_TDATA_NUM_BYTES 4 \
  CONFIG.S_HAS_TKEEP 0 \
  CONFIG.S_HAS_TLAST 0 \
  CONFIG.S_HAS_TREADY 0 \
  CONFIG.S_TDATA_NUM_BYTES 4 \
  CONFIG.TDATA_REMAP {tdata[31:0]} \
  CONFIG.TKEEP_REMAP {1'b0} \
] [get_bd_cells axis_subset_converter_0]

# ---- hierarchy /dino/float_to_int32 ----
current_bd_instance /dino/float_to_int32
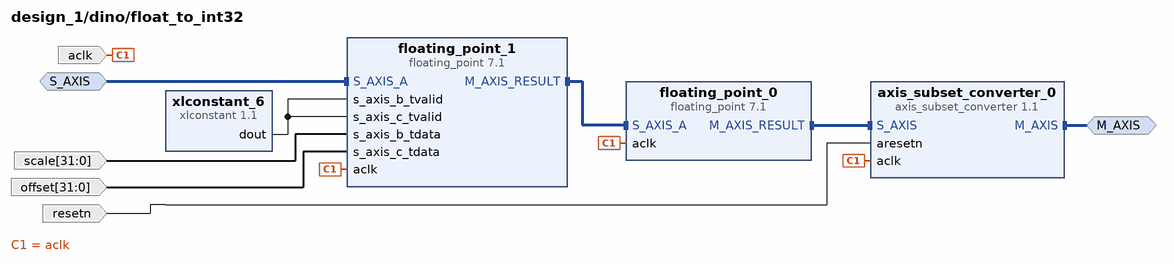
[diagram p8: block diagram inside /dino/float_to_int32]
create_bd_intf_pin -mode Slave -vlnv xilinx.com:interface:axis_rtl:1.0 S_AXIS
create_bd_intf_pin -mode Master -vlnv xilinx.com:interface:axis_rtl:1.0 M_AXIS
create_bd_pin -dir I -type clk aclk
create_bd_pin -dir I -type rst resetn
create_bd_pin -dir I -from 31 -to 0 scale
create_bd_pin -dir I -from 31 -to 0 offset

create_bd_cell -type ip -vlnv xilinx.com:ip:floating_point:7.1 floating_point_1
set_property -dict [list \
  CONFIG.Add_Sub_Value Add \
  CONFIG.C_Latency 4 \
  CONFIG.C_Mult_Usage Medium_Usage \
  CONFIG.C_Rate 1 \
  CONFIG.C_Result_Exponent_Width 8 \
  CONFIG.C_Result_Fraction_Width 24 \
  CONFIG.Flow_Control NonBlocking \
  CONFIG.Has_RESULT_TREADY false \
  CONFIG.Maximum_Latency false \
  CONFIG.Operation_Type FMA \
  CONFIG.Result_Precision_Type Single \
] [get_bd_cells floating_point_1]
create_bd_cell -type ip -vlnv xilinx.com:ip:floating_point:7.1 floating_point_0
set_property -dict [list \
  CONFIG.A_Precision_Type Single \
  CONFIG.C_A_Exponent_Width 8 \
  CONFIG.C_A_Fraction_Width 24 \
  CONFIG.C_Accum_Input_Msb 32 \
  CONFIG.C_Accum_Lsb -31 \
  CONFIG.C_Accum_Msb 32 \
  CONFIG.C_Latency 6 \
  CONFIG.C_Mult_Usage No_Usage \
  CONFIG.C_Rate 1 \
  CONFIG.C_Result_Exponent_Width 17 \
  CONFIG.C_Result_Fraction_Width 0 \
  CONFIG.Flow_Control NonBlocking \
  CONFIG.Has_RESULT_TREADY false \
  CONFIG.Maximum_Latency false \
  CONFIG.Operation_Type Float_to_fixed \
  CONFIG.Result_Precision_Type Custom \
] [get_bd_cells floating_point_0]
create_bd_cell -type ip -vlnv xilinx.com:ip:xlconstant:1.1 xlconstant_6
create_bd_cell -type ip -vlnv xilinx.com:ip:axis_subset_converter:1.1 axis_subset_converter_0
set_property -dict [list \
  CONFIG.M_TDATA_NUM_BYTES 2 \
  CONFIG.S_TDATA_NUM_BYTES 3 \
  CONFIG.TDATA_REMAP {tdata[15:0]} \
] [get_bd_cells axis_subset_converter_0]

# ---- connections ----

current_bd_instance /dma_pcie
connect_bd_intf_net [get_bd_intf_pins PCIE_REFCLK] [get_bd_intf_pins pcie/PCIE_REFCLK]
connect_bd_intf_net [get_bd_intf_pins pcie/S_AXI] [get_bd_intf_pins axi_interconnect_1/M00_AXI]
connect_bd_intf_net [get_bd_intf_pins M04_AXI] [get_bd_intf_pins axi_interconnect_0/M04_AXI]
connect_bd_intf_net [get_bd_intf_pins M05_AXI] [get_bd_intf_pins axi_interconnect_0/M05_AXI]
connect_bd_intf_net [get_bd_intf_pins axi_interconnect_1/S01_AXI] [get_bd_intf_pins axi_dma_0/M_AXI_MM2S]
connect_bd_intf_net [get_bd_intf_pins axi_interconnect_1/S02_AXI] [get_bd_intf_pins axi_dma_0/M_AXI_S2MM]
connect_bd_intf_net [get_bd_intf_pins M_AXIS_MM2S] [get_bd_intf_pins axi_dma_0/M_AXIS_MM2S]
connect_bd_intf_net [get_bd_intf_pins axi_dma_0/M_AXI_SG] [get_bd_intf_pins axi_read_cache_0/S_AXI]
connect_bd_intf_net [get_bd_intf_pins axi_dma_0/M_AXI_SG] [get_bd_intf_pins pcie/SLOT_2_AXI]
connect_bd_intf_net [get_bd_intf_pins M00_AXI1] [get_bd_intf_pins axi_interconnect_0/M00_AXI]
connect_bd_intf_net [get_bd_intf_pins axi_interconnect_0/M01_AXI] [get_bd_intf_pins axi_dma_0/S_AXI_LITE]
connect_bd_intf_net [get_bd_intf_pins M00_AXI] [get_bd_intf_pins axi_interconnect_0/M02_AXI]
connect_bd_intf_net [get_bd_intf_pins axi_interconnect_0/M03_AXI] [get_bd_intf_pins pcie/s_axi_intc]
connect_bd_intf_net [get_bd_intf_pins axi_interconnect_0/M06_AXI] [get_bd_intf_pins axi_read_cache_0/REG_S_AXI]
connect_bd_intf_net [get_bd_intf_pins axi_interconnect_1/M01_AXI] [get_bd_intf_pins pcie/S_AXI_CTL]
connect_bd_intf_net [get_bd_intf_pins pcie/M_AXI] [get_bd_intf_pins axi_interconnect_0/S00_AXI]
connect_bd_intf_net [get_bd_intf_pins pcie_7x_mgt_0] [get_bd_intf_pins pcie/pcie_7x_mgt_0]
connect_bd_intf_net [get_bd_intf_pins axi_read_cache_0/M_AXI] [get_bd_intf_pins axi_interconnect_1/S00_AXI]
connect_bd_intf_net [get_bd_intf_pins S_AXIS_S2MM] [get_bd_intf_pins axi_dma_0/S_AXIS_S2MM]
connect_bd_net -net In2_1 [get_bd_pins In2] [get_bd_pins pcie/In2]
connect_bd_net [get_bd_pins axi_dma_0/mm2s_introut] [get_bd_pins pcie/intr_dma_mm2s]
connect_bd_net [get_bd_pins axi_dma_0/s2mm_introut] [get_bd_pins pcie/intr_dma_s2mm]
connect_bd_net -net axi_pcie_0_axi_aclk_out [get_bd_pins pcie/s_axi_aclk] \
  [get_bd_pins s_axi_aclk] [get_bd_pins axi_interconnect_0/ACLK] [get_bd_pins axi_interconnect_0/S00_ACLK] \
  [get_bd_pins axi_interconnect_0/M00_ACLK] [get_bd_pins axi_interconnect_0/M01_ACLK] [get_bd_pins axi_dma_0/m_axi_sg_aclk] \
  [get_bd_pins axi_dma_0/m_axi_mm2s_aclk] [get_bd_pins axi_dma_0/m_axi_s2mm_aclk] [get_bd_pins axi_interconnect_1/ACLK] \
  [get_bd_pins axi_interconnect_1/S00_ACLK] [get_bd_pins axi_interconnect_1/M00_ACLK] \
  [get_bd_pins axi_interconnect_1/S01_ACLK] [get_bd_pins axi_interconnect_1/S02_ACLK] \
  [get_bd_pins axi_interconnect_0/M03_ACLK] [get_bd_pins axi_dma_0/s_axi_lite_aclk] [get_bd_pins axi_interconnect_0/M04_ACLK] \
  [get_bd_pins axi_interconnect_0/M02_ACLK] [get_bd_pins axi_interconnect_0/M05_ACLK] \
  [get_bd_pins axi_interconnect_0/M06_ACLK] [get_bd_pins axi_read_cache_0/ACLK]
connect_bd_net -net axi_pcie_0_axi_ctl_aclk_out [get_bd_pins pcie/axi_ctl_aclk_out] \
  [get_bd_pins axi_ctl_aclk_out] [get_bd_pins axi_interconnect_1/M01_ACLK]
connect_bd_net -net axi_pcie_0_mmcm_lock [get_bd_pins pcie/mmcm_lock] [get_bd_pins mmcm_lock]
connect_bd_net -net proc_sys_reset_0_interconnect_aresetn [get_bd_pins ARESETN] \
  [get_bd_pins axi_interconnect_0/ARESETN] [get_bd_pins axi_interconnect_0/S00_ARESETN] \
  [get_bd_pins axi_interconnect_0/M00_ARESETN] [get_bd_pins axi_interconnect_0/M01_ARESETN] \
  [get_bd_pins axi_interconnect_1/S02_ARESETN] [get_bd_pins axi_interconnect_1/S01_ARESETN] \
  [get_bd_pins axi_interconnect_1/M00_ARESETN] [get_bd_pins axi_interconnect_1/S00_ARESETN] \
  [get_bd_pins axi_interconnect_1/ARESETN] [get_bd_pins axi_interconnect_0/M03_ARESETN] [get_bd_pins pcie/s_axi_aresetn] \
  [get_bd_pins axi_dma_0/axi_resetn] [get_bd_pins axi_interconnect_0/M04_ARESETN] \
  [get_bd_pins axi_interconnect_0/M02_ARESETN] [get_bd_pins axi_interconnect_0/M05_ARESETN] \
  [get_bd_pins axi_interconnect_0/M06_ARESETN] [get_bd_pins axi_read_cache_0/ARESETN]
connect_bd_net -net proc_sys_reset_0_peripheral_aresetn [get_bd_pins M01_ARESETN] [get_bd_pins axi_interconnect_1/M01_ARESETN]

current_bd_instance /dma_pcie/pcie
connect_bd_intf_net [get_bd_intf_pins PCIE_REFCLK] [get_bd_intf_pins util_ds_buf_1/CLK_IN_D]
connect_bd_intf_net [get_bd_intf_pins S_AXI] [get_bd_intf_pins axi_pcie_0/S_AXI]
connect_bd_intf_net [get_bd_intf_pins S_AXI] [get_bd_intf_pins system_ila_1/SLOT_1_AXI]
connect_bd_intf_net [get_bd_intf_pins system_ila_1/SLOT_2_AXI] [get_bd_intf_pins SLOT_2_AXI]
connect_bd_intf_net [get_bd_intf_pins s_axi_intc] [get_bd_intf_pins pcie_interrupts/s_axi]
connect_bd_intf_net [get_bd_intf_pins S_AXI_CTL] [get_bd_intf_pins axi_pcie_0/S_AXI_CTL]
connect_bd_intf_net [get_bd_intf_pins M_AXI] [get_bd_intf_pins axi_pcie_0/M_AXI]
connect_bd_intf_net [get_bd_intf_pins M_AXI] [get_bd_intf_pins system_ila_1/SLOT_0_AXI]
connect_bd_intf_net [get_bd_intf_pins pcie_7x_mgt_0] [get_bd_intf_pins axi_pcie_0/pcie_7x_mgt]
connect_bd_net -net In2_1 [get_bd_pins In2] [get_bd_pins pcie_interrupts/In2] [get_bd_pins system_ila_1/probe2]
connect_bd_net -net axi_dma_0_mm2s_introut [get_bd_pins intr_dma_mm2s] [get_bd_pins pcie_interrupts/intr_dma_mm2s] [get_bd_pins system_ila_1/probe0]
connect_bd_net -net axi_dma_0_s2mm_introut [get_bd_pins intr_dma_s2mm] [get_bd_pins pcie_interrupts/intr_dma_s2mm] [get_bd_pins system_ila_1/probe1]
connect_bd_net [get_bd_pins axi_pcie_0/INTX_MSI_Grant] [get_bd_pins pcie_interrupts/INTX_MSI_Grant] [get_bd_pins system_ila_1/probe5]
connect_bd_net [get_bd_pins axi_pcie_0/MSI_Vector_Width] [get_bd_pins pcie_interrupts/MSI_Vector_Width] [get_bd_pins system_ila_1/probe7]
connect_bd_net [get_bd_pins axi_pcie_0/MSI_enable] [get_bd_pins pcie_interrupts/MSI_Enable] [get_bd_pins system_ila_1/probe6]
connect_bd_net [get_bd_pins axi_pcie_0/axi_aclk_out] [get_bd_pins s_axi_aclk] [get_bd_pins pcie_interrupts/s_axi_aclk] [get_bd_pins system_ila_1/clk]
connect_bd_net [get_bd_pins axi_pcie_0/axi_ctl_aclk_out] [get_bd_pins axi_ctl_aclk_out]
connect_bd_net [get_bd_pins axi_pcie_0/mmcm_lock] [get_bd_pins mmcm_lock]
connect_bd_net -net axi_pcie_intc_0_INTX_MSI_Request [get_bd_pins pcie_interrupts/INTX_MSI_Request] \
  [get_bd_pins axi_pcie_0/INTX_MSI_Request] [get_bd_pins system_ila_1/probe4]
connect_bd_net -net axi_pcie_intc_0_MSI_Vector_Num [get_bd_pins pcie_interrupts/MSI_Vector_Num] \
  [get_bd_pins axi_pcie_0/MSI_Vector_Num] [get_bd_pins system_ila_1/probe3]
connect_bd_net -net proc_sys_reset_0_interconnect_aresetn [get_bd_pins s_axi_aresetn] \
  [get_bd_pins pcie_interrupts/s_axi_aresetn] [get_bd_pins axi_pcie_0/axi_aresetn] [get_bd_pins system_ila_1/resetn]
connect_bd_net [get_bd_pins util_ds_buf_1/IBUF_OUT] [get_bd_pins axi_pcie_0/REFCLK]

current_bd_instance /dma_pcie/pcie/pcie_interrupts
connect_bd_intf_net [get_bd_intf_pins s_axi] [get_bd_intf_pins axi_pcie_intc_0/s_axi]
connect_bd_net -net In2_1 [get_bd_pins In2] [get_bd_pins xlconcat_0/In2]
connect_bd_net -net axi_dma_0_mm2s_introut [get_bd_pins intr_dma_mm2s] [get_bd_pins xlconcat_0/In0]
connect_bd_net -net axi_dma_0_s2mm_introut [get_bd_pins intr_dma_s2mm] [get_bd_pins xlconcat_0/In1]
connect_bd_net -net axi_pcie_0_INTX_MSI_Grant [get_bd_pins INTX_MSI_Grant] [get_bd_pins axi_pcie_intc_0/INTX_MSI_Grant]
connect_bd_net -net axi_pcie_0_MSI_Vector_Width [get_bd_pins MSI_Vector_Width] [get_bd_pins axi_pcie_intc_0/MSI_Vector_Width]
connect_bd_net -net axi_pcie_0_MSI_enable [get_bd_pins MSI_Enable] [get_bd_pins axi_pcie_intc_0/MSI_Enable]
connect_bd_net -net axi_pcie_0_axi_aclk_out [get_bd_pins s_axi_aclk] [get_bd_pins axi_pcie_intc_0/s_axi_aclk]
connect_bd_net [get_bd_pins axi_pcie_intc_0/INTX_MSI_Request] [get_bd_pins INTX_MSI_Request]
connect_bd_net [get_bd_pins axi_pcie_intc_0/MSI_Vector_Num] [get_bd_pins MSI_Vector_Num]
connect_bd_net -net proc_sys_reset_0_interconnect_aresetn [get_bd_pins s_axi_aresetn] [get_bd_pins axi_pcie_intc_0/s_axi_aresetn]
connect_bd_net [get_bd_pins xlconcat_0/dout] [get_bd_pins axi_pcie_intc_0/intr]
connect_bd_net [get_bd_pins xlconstant_2/dout] [get_bd_pins xlconcat_0/In3]

current_bd_instance /aurora
connect_bd_intf_net [get_bd_intf_pins GT_DIFF_REFCLK1_0] [get_bd_intf_pins util_ds_buf_0/CLK_IN_D]
connect_bd_intf_net [get_bd_intf_pins GT_SERIAL_RX_0] [get_bd_intf_pins aurora_8b10b_ch0/GT_SERIAL_RX]
connect_bd_intf_net [get_bd_intf_pins GT_SERIAL_RX_1] [get_bd_intf_pins aurora_8b10b_ch1/GT_SERIAL_RX]
connect_bd_intf_net [get_bd_intf_pins GT_SERIAL_RX_2] [get_bd_intf_pins aurora_8b10b_ch2/GT_SERIAL_RX]
connect_bd_intf_net [get_bd_intf_pins GT_SERIAL_RX_3] [get_bd_intf_pins aurora_8b10b_ch3/GT_SERIAL_RX]
connect_bd_intf_net [get_bd_intf_pins USER_DATA_M_AXI_RX] [get_bd_intf_pins aurora_8b10b_ch0/USER_DATA_M_AXI_RX]
connect_bd_intf_net [get_bd_intf_pins USER_DATA_M_AXI_RX2] [get_bd_intf_pins aurora_8b10b_ch2/USER_DATA_M_AXI_RX]
connect_bd_intf_net [get_bd_intf_pins USER_DATA_M_AXI_RX3] [get_bd_intf_pins aurora_8b10b_ch3/USER_DATA_M_AXI_RX]
connect_bd_intf_net [get_bd_intf_pins GT_SERIAL_TX_0] [get_bd_intf_pins aurora_8b10b_ch0/GT_SERIAL_TX]
connect_bd_intf_net [get_bd_intf_pins GT_SERIAL_TX_1] [get_bd_intf_pins aurora_8b10b_ch1/GT_SERIAL_TX]
connect_bd_intf_net [get_bd_intf_pins GT_SERIAL_TX_3] [get_bd_intf_pins aurora_8b10b_ch3/GT_SERIAL_TX]
connect_bd_intf_net [get_bd_intf_pins GT_SERIAL_TX_2] [get_bd_intf_pins aurora_8b10b_ch2/GT_SERIAL_TX]
connect_bd_intf_net [get_bd_intf_pins USER_DATA_S_AXI_TX] [get_bd_intf_pins aurora_8b10b_ch0/USER_DATA_S_AXI_TX]
connect_bd_intf_net [get_bd_intf_pins USER_DATA_S_AXI_TX1] [get_bd_intf_pins aurora_8b10b_ch1/USER_DATA_S_AXI_TX]
connect_bd_intf_net [get_bd_intf_pins USER_DATA_S_AXI_TX2] [get_bd_intf_pins aurora_8b10b_ch2/USER_DATA_S_AXI_TX]
connect_bd_intf_net [get_bd_intf_pins USER_DATA_S_AXI_TX3] [get_bd_intf_pins aurora_8b10b_ch3/USER_DATA_S_AXI_TX]
connect_bd_intf_net [get_bd_intf_pins USER_DATA_M_AXI_RX1] [get_bd_intf_pins aurora_8b10b_ch1/USER_DATA_M_AXI_RX]
connect_bd_net [get_bd_pins clk] \
  [get_bd_pins aurora_demo_0/clk] [get_bd_pins aurora_8b10b_ch2/init_clk_in] [get_bd_pins aurora_8b10b_ch3/init_clk_in] \
  [get_bd_pins aurora_8b10b_ch2/drpclk_in] [get_bd_pins aurora_8b10b_ch3/drpclk_in] [get_bd_pins aurora_8b10b_ch0/drpclk_in] \
  [get_bd_pins aurora_8b10b_ch0/init_clk_in] [get_bd_pins aurora_8b10b_ch1/drpclk_in] \
  [get_bd_pins aurora_8b10b_ch1/init_clk_in]
connect_bd_net -net aurora_8b10b_0_gt_reset_out [get_bd_pins aurora_8b10b_ch0/gt_reset_out] \
  [get_bd_pins aurora_8b10b_ch2/gt_reset] [get_bd_pins aurora_8b10b_ch3/gt_reset] [get_bd_pins aurora_8b10b_ch1/gt_reset]
connect_bd_net -net aurora_8b10b_0_pll_not_locked_out [get_bd_pins aurora_8b10b_ch0/pll_not_locked_out] \
  [get_bd_pins aurora_8b10b_ch3/pll_not_locked] [get_bd_pins aurora_8b10b_ch2/pll_not_locked] \
  [get_bd_pins aurora_8b10b_ch1/pll_not_locked]
connect_bd_net -net aurora_8b10b_0_sync_clk_out [get_bd_pins aurora_8b10b_ch0/sync_clk_out] \
  [get_bd_pins aurora_8b10b_ch2/sync_clk] [get_bd_pins aurora_8b10b_ch3/sync_clk] [get_bd_pins aurora_8b10b_ch1/sync_clk]
connect_bd_net -net aurora_8b10b_0_sys_reset_out [get_bd_pins aurora_8b10b_ch0/sys_reset_out] \
  [get_bd_pins aurora_8b10b_ch2/reset] [get_bd_pins aurora_8b10b_ch3/reset] [get_bd_pins util_vector_logic_0/Op1] \
  [get_bd_pins aurora_8b10b_ch1/reset]
connect_bd_net -net aurora_8b10b_0_user_clk_out [get_bd_pins aurora_8b10b_ch0/user_clk_out] \
  [get_bd_pins user_clk] [get_bd_pins aurora_8b10b_ch1/user_clk] [get_bd_pins aurora_8b10b_ch3/user_clk] \
  [get_bd_pins aurora_8b10b_ch2/user_clk] [get_bd_pins aurora_ila_0/clk]
connect_bd_net [get_bd_pins aurora_8b10b_ch0/channel_up] [get_bd_pins channel_up/In0]
connect_bd_net [get_bd_pins aurora_8b10b_ch0/frame_err] [get_bd_pins frame_err/In0]
connect_bd_net [get_bd_pins aurora_8b10b_ch0/gt_qpllclk_quad1_out] \
  [get_bd_pins aurora_8b10b_ch2/gt_qpllclk_quad7_in] [get_bd_pins aurora_8b10b_ch3/gt_qpllclk_quad7_in] \
  [get_bd_pins aurora_8b10b_ch1/gt_qpllclk_quad1_in]
connect_bd_net [get_bd_pins aurora_8b10b_ch0/gt_qpllrefclk_quad1_out] \
  [get_bd_pins aurora_8b10b_ch2/gt_qpllrefclk_quad7_in] [get_bd_pins aurora_8b10b_ch3/gt_qpllrefclk_quad7_in] \
  [get_bd_pins aurora_8b10b_ch1/gt_qpllrefclk_quad1_in]
connect_bd_net [get_bd_pins aurora_8b10b_ch0/hard_err] [get_bd_pins hard_err/In0]
connect_bd_net [get_bd_pins aurora_8b10b_ch0/lane_up] [get_bd_pins lane_up/In0]
connect_bd_net [get_bd_pins aurora_8b10b_ch0/soft_err] [get_bd_pins soft_err/In0]
connect_bd_net [get_bd_pins aurora_8b10b_ch0/tx_lock] [get_bd_pins tx_lock/In0]
connect_bd_net [get_bd_pins aurora_8b10b_ch1/channel_up] [get_bd_pins channel_up/In1]
connect_bd_net [get_bd_pins aurora_8b10b_ch1/frame_err] [get_bd_pins frame_err/In1]
connect_bd_net [get_bd_pins aurora_8b10b_ch1/hard_err] [get_bd_pins hard_err/In1]
connect_bd_net [get_bd_pins aurora_8b10b_ch1/lane_up] [get_bd_pins lane_up/In1]
connect_bd_net [get_bd_pins aurora_8b10b_ch1/soft_err] [get_bd_pins soft_err/In1]
connect_bd_net [get_bd_pins aurora_8b10b_ch1/tx_lock] [get_bd_pins tx_lock/In1]
connect_bd_net [get_bd_pins aurora_8b10b_ch2/channel_up] [get_bd_pins channel_up/In2]
connect_bd_net [get_bd_pins aurora_8b10b_ch2/frame_err] [get_bd_pins frame_err/In2]
connect_bd_net [get_bd_pins aurora_8b10b_ch2/hard_err] [get_bd_pins hard_err/In2]
connect_bd_net [get_bd_pins aurora_8b10b_ch2/lane_up] [get_bd_pins lane_up/In2]
connect_bd_net [get_bd_pins aurora_8b10b_ch2/soft_err] [get_bd_pins soft_err/In2]
connect_bd_net [get_bd_pins aurora_8b10b_ch2/tx_lock] [get_bd_pins tx_lock/In2]
connect_bd_net [get_bd_pins aurora_8b10b_ch3/channel_up] [get_bd_pins channel_up/In3]
connect_bd_net [get_bd_pins aurora_8b10b_ch3/frame_err] [get_bd_pins frame_err/In3]
connect_bd_net [get_bd_pins aurora_8b10b_ch3/hard_err] [get_bd_pins hard_err/In3]
connect_bd_net [get_bd_pins aurora_8b10b_ch3/lane_up] [get_bd_pins lane_up/In3]
connect_bd_net [get_bd_pins aurora_8b10b_ch3/soft_err] [get_bd_pins soft_err/In3]
connect_bd_net [get_bd_pins aurora_8b10b_ch3/tx_lock] [get_bd_pins tx_lock/In3]
connect_bd_net [get_bd_pins aurora_demo_0/reset] [get_bd_pins aurora_8b10b_ch0/reset] [get_bd_pins aurora_8b10b_ch0/gt_reset]
connect_bd_net [get_bd_pins channel_up/dout] [get_bd_pins aurora_ila_0/probe5]
connect_bd_net [get_bd_pins frame_err/dout] [get_bd_pins aurora_ila_0/probe4]
connect_bd_net [get_bd_pins hard_err/dout] [get_bd_pins aurora_ila_0/probe3]
connect_bd_net [get_bd_pins lane_up/dout] [get_bd_pins aurora_ila_0/probe2]
connect_bd_net [get_bd_pins soft_err/dout] [get_bd_pins aurora_ila_0/probe1]
connect_bd_net [get_bd_pins tx_lock/dout] [get_bd_pins aurora_ila_0/probe0]
connect_bd_net [get_bd_pins util_ds_buf_0/IBUF_OUT] \
  [get_bd_pins aurora_8b10b_ch2/gt_refclk1] [get_bd_pins aurora_8b10b_ch3/gt_refclk1] \
  [get_bd_pins aurora_8b10b_ch0/gt_refclk1] [get_bd_pins aurora_8b10b_ch1/gt_refclk1]
connect_bd_net [get_bd_pins util_vector_logic_0/Res] [get_bd_pins aurora_reset] [get_bd_pins aurora_ila_0/probe6]
connect_bd_net [get_bd_pins xlconstant_0/dout] \
  [get_bd_pins aurora_8b10b_ch2/loopback] [get_bd_pins aurora_8b10b_ch3/loopback] [get_bd_pins aurora_8b10b_ch0/loopback] \
  [get_bd_pins aurora_8b10b_ch1/loopback]
connect_bd_net [get_bd_pins xlconstant_1/dout] \
  [get_bd_pins aurora_8b10b_ch3/power_down] [get_bd_pins aurora_8b10b_ch2/power_down] \
  [get_bd_pins aurora_8b10b_ch0/power_down] [get_bd_pins aurora_8b10b_ch1/power_down]
